# Altium schematic sheet bulk_capacitance.SchDoc
size A4; SheetNumber: 4; SheetTotal: 11
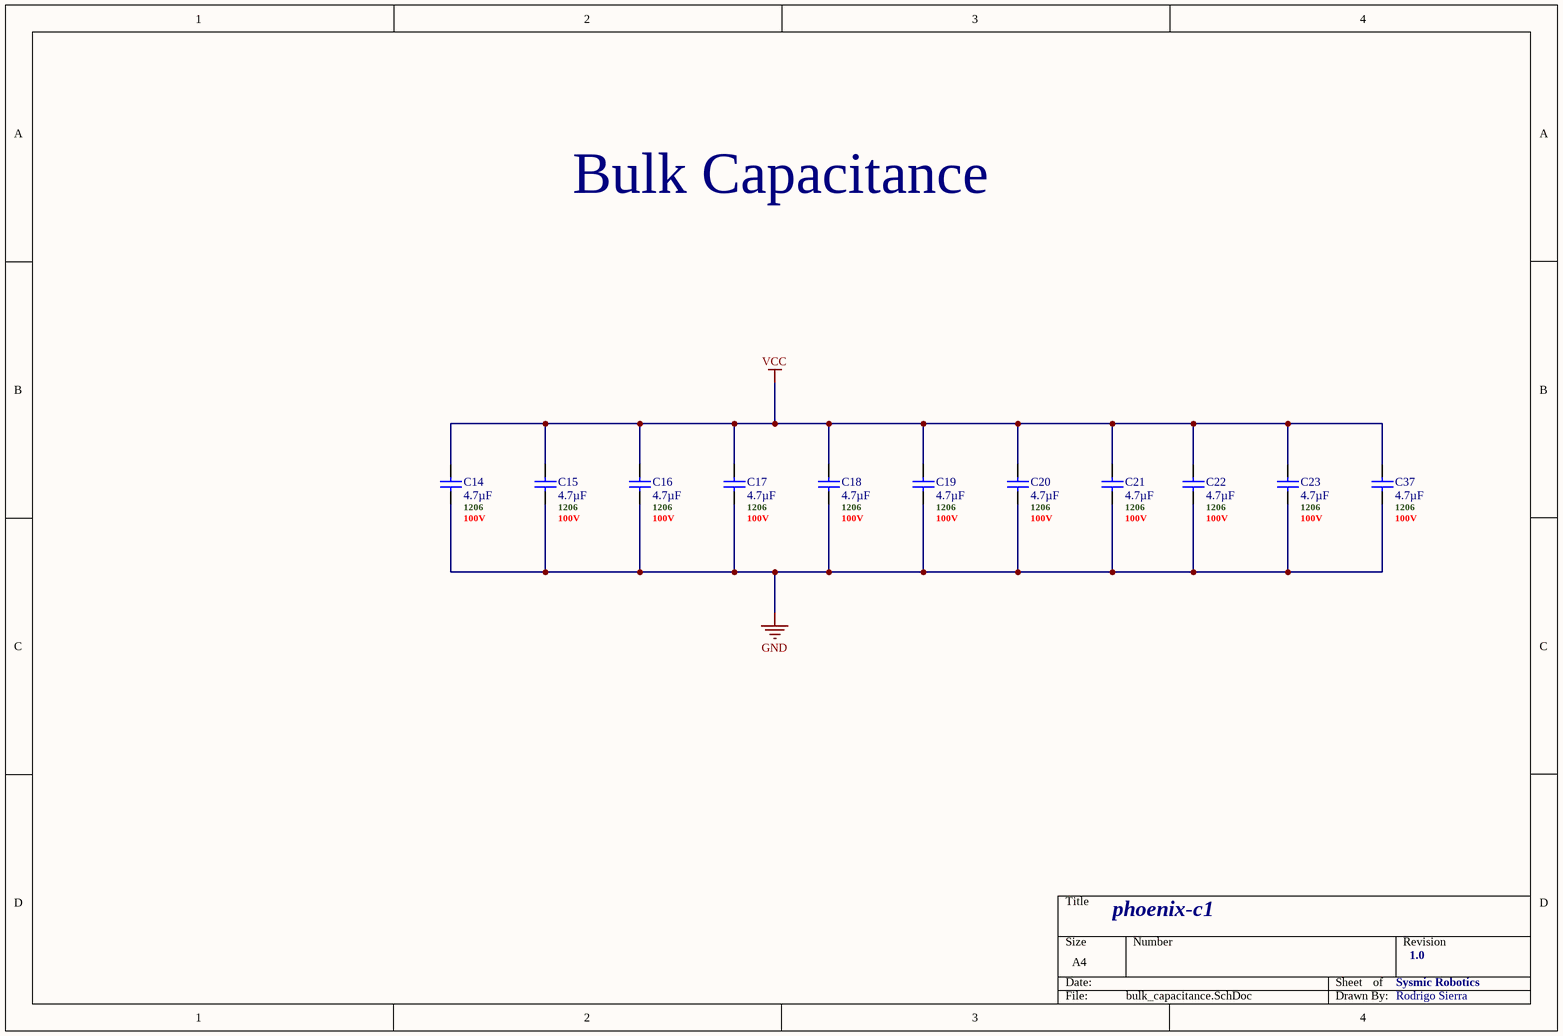
[diagram p0: bulk_capacitance.SchDoc]

## Parts
C14  4.7µF  .Case/Package: 1206  .Voltage Rating (DC): 100V  [C1206 - MURATA]
C15  4.7µF  .Case/Package: 1206  .Voltage Rating (DC): 100V  [C1206 - MURATA]
C16  4.7µF  .Case/Package: 1206  .Voltage Rating (DC): 100V  [C1206 - MURATA]
C17  4.7µF  .Case/Package: 1206  .Voltage Rating (DC): 100V  [C1206 - MURATA]
C18  4.7µF  .Case/Package: 1206  .Voltage Rating (DC): 100V  [C1206 - MURATA]
C19  4.7µF  .Case/Package: 1206  .Voltage Rating (DC): 100V  [C1206 - MURATA]
C20  4.7µF  .Case/Package: 1206  .Voltage Rating (DC): 100V  [C1206 - MURATA]
C21  4.7µF  .Case/Package: 1206  .Voltage Rating (DC): 100V  [C1206 - MURATA]
C22  4.7µF  .Case/Package: 1206  .Voltage Rating (DC): 100V  [C1206 - MURATA]
C23  4.7µF  .Case/Package: 1206  .Voltage Rating (DC): 100V  [C1206 - MURATA]
C37  4.7µF  .Case/Package: 1206  .Voltage Rating (DC): 100V  [C1206 - MURATA]

## Nets
GND: C14.2 C15.2 C16.2 C17.2 C18.2 C19.2 C20.2 C21.2 C22.2 C23.2 C37.2
VCC: C14.1 C15.1 C16.1 C17.1 C18.1 C19.1 C20.1 C21.1 C22.1 C23.1 C37.1

## Notes on the sheet
- Bulk Capacitance
- phoenix-c1
- Sysmic Robotics
- 1.0
- Rodrigo Sierra

## Library data of the parts
C14-C23 C37 = GRJ31CC72A475KE01K: Ceramic Capacitor, Multilayer, Ceramic, 100V, 10% +Tol, 10% -Tol, X7S, 22% TC, 4.7uF, Surface Mount, 1206; Manufacturer: Murata; Manufacturer Lifecycle Status: IN PRODUCTION; Supplier: Mouser; Supplier Part Number: 81-GRJ31CC72A475KE1K; Manufacturer Part Number: GRJ31CC72A475KE01K; RoHS: Compliant; Category: Ceramic Capacitors; Stock: 47114; Pricing: 1=0,8, 10=0,387, 50=0,387, 100=0,351, 1000=0,272, 10000=0,242 (USD); Value: 4.7µF; Case/Package: 1206; Dielectric: X7S; Dielectric Material: Ceramic; Height: 1.6mm; Length: 3.2mm; Lifecycle Status: Production; Max Operating Temperature: 125°C; Min Operating Temperature: -55°C; Mounting Technology: Surface Mount; Number of Terminals: 2; REACH SVHC: Yes; Thickness: 1.6mm; Voltage Rating (DC): 100V; Width: 1.6mm; ComponentLink1URL: https://datasheet.octopart.com:443/GRJ31CC72A475KE01K-Murata-datasheet-165579666.pdf?src-supplier=TME; ComponentLink1Description: https://datasheet.octopart.com:443/GRJ31CC72A475KE01K-Murata-datasheet-165579666.pdf?src-supplier=TME; ComponentLink2URL: https://datasheet.octopart.com/GRJ31CC72A475KE01K-Murata-datasheet-12515295.pdf; ComponentLink2Description: https://datasheet.octopart.com/GRJ31CC72A475KE01K-Murata-datasheet-12515295.pdf; ComponentLink3URL: https://datasheet.octopart.com/GRJ31CC72A475KE01K-Murata-datasheet-12510076.pdf; ComponentLink3Description: https://datasheet.octopart.com/GRJ31CC72A475KE01K-Murata-datasheet-12510076.pdf; ComponentLink4URL: https://datasheet.octopart.com/GRJ31CC72A475KE01K-Murata-datasheet-11978611.pdf; ComponentLink4Description: https://datasheet.octopart.com/GRJ31CC72A475KE01K-Murata-datasheet-11978611.pdf; ComponentLink5URL: https://datasheet.octopart.com/GRJ31CC72A475KE01K-Murata-datasheet-10025737.pdf; ComponentLink5Description: https://datasheet.octopart.com/GRJ31CC72A475KE01K-Murata-datasheet-10025737.pdf; ComponentLink6URL: https://datasheet.octopart.com/GRJ31CC72A475KE01K-Murata-datasheet-8819587.pdf; ComponentLink6Description: https://datasheet.octopart.com/GRJ31CC72A475KE01K-Murata-datasheet-8819587.pdf; ComponentLink7URL: http://sigma.octopart.com:80/reach_statement/Murata-company-16.pdf?src-supplier=Compliance+Statements; ComponentLink7Description: http://sigma.octopart.com:80/reach_statement/Murata-company-16.pdf?src-supplier=Compliance+Statements; Supplier 1: Mouser; Supplier Part Number 1: 81-GRJ31CC72A475KE1K